# Altium schematic sheet UZ_A_Testboard_Block_Diagram.SchDoc
size A4; PageSetup: Record=PageOptions|CenterHorizontal=True|CenterVertical=True|PrintScale=0.92|XCorrection=1.00|YCorrection=1.00|PrintKind=0|BorderSize=5000000|LeftOffset=0|BottomOffset=0|Orientation=2|PaperLength=1000|PaperWidth=1000|Scale=100|PaperSource=7|PrintQuality=-4|MediaType=1|DitherType=10|PrintScaleMode=1|PaperKind=A4; CompanyName: Technische Hochschule Nürnberg Georg Simon Ohm; Organization: UltraZohm; Address1: Kesslerplatz 12; Address2: 90489 Nürnberg; Address3: GERMANY; DocumentNumber: 1; SheetNumber: 1; SheetTotal: 2; Website: www.ultrazohm.com
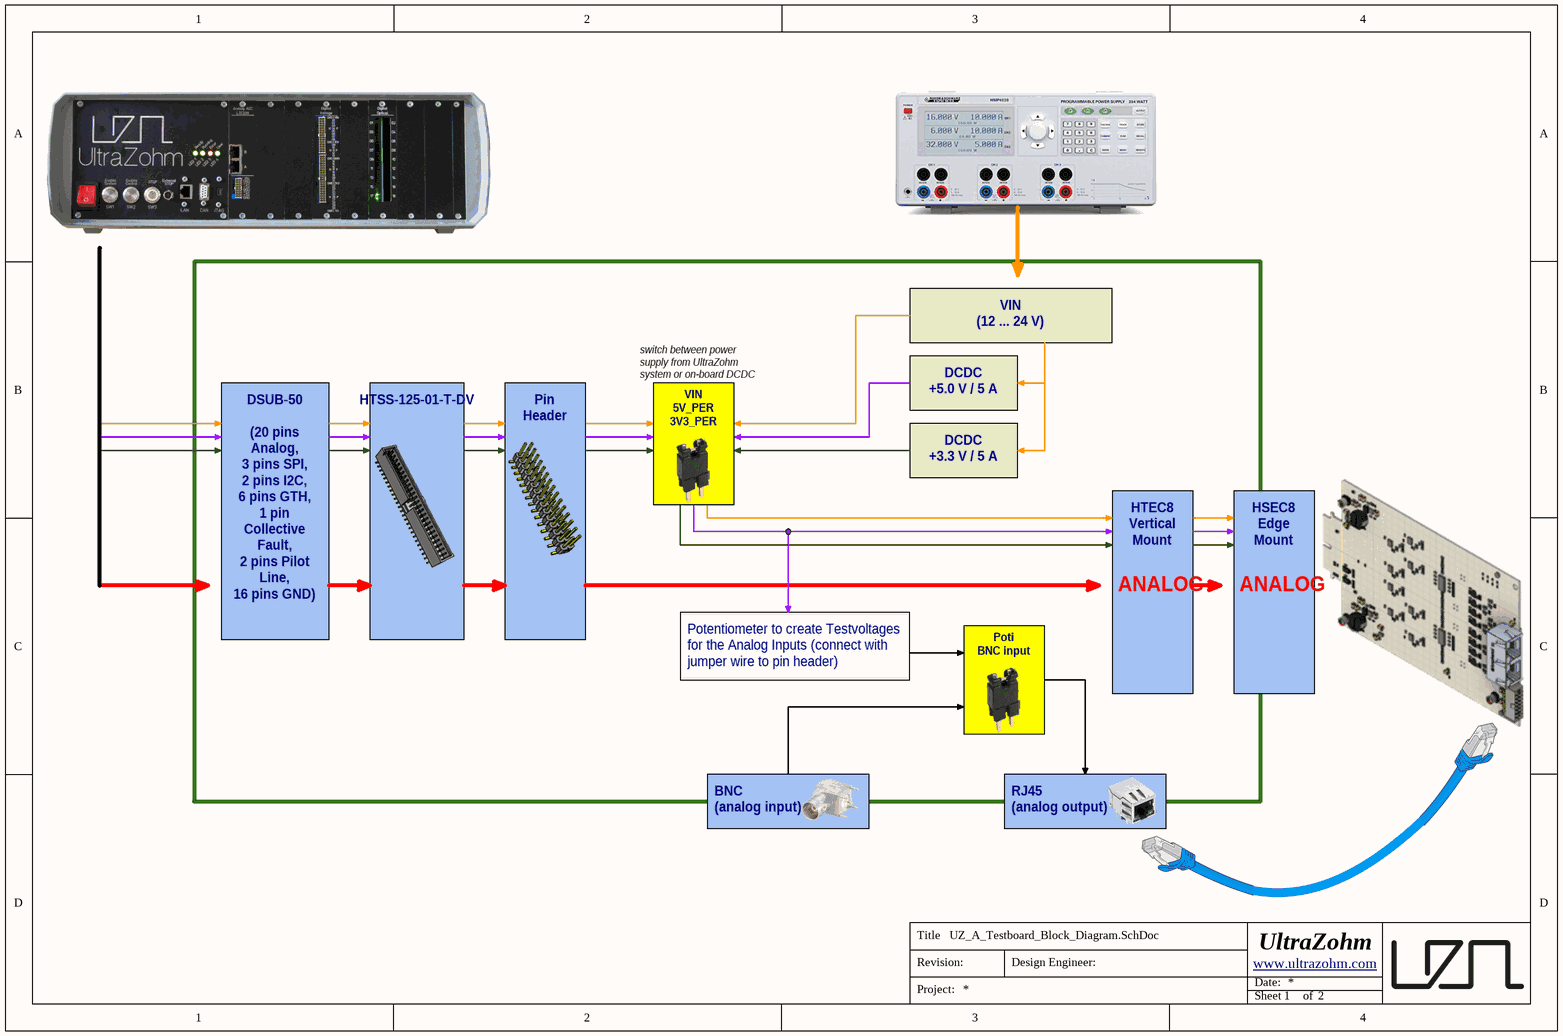
[diagram p0: UZ_A_Testboard_Block_Diagram.SchDoc]

## Notes on the sheet
- switch between power supply from UltraZohm system or on-board DCDC
- VIN
  (12 ... 24 V)
- DCDC
  +5.0 V / 5 A
- VIN
  5V_PER
  3V3_PER
- DCDC
  +3.3 V / 5 A
- DSUB-50
  (20 pins Analog,
  3 pins SPI,
  2 pins I2C,
  6 pins GTH,
  1 pin Collective Fault,
  2 pins Pilot Line,
  16 pins GND)
- HTSS-125-01-T-DV
- Pin Header
- ANALOG
- Potentiometer to create Testvoltages for the Analog Inputs (connect with jumper wire to pin header)
- HTEC8
  Vertical Mount
- HSEC8
  Edge Mount
- Poti
  BNC input
- BNC
  (analog input)
- RJ45
  (analog output)
- Title
- Revision:
- Design Engineer:
- Date:
- Project:
- Sheet
- of